# EAGLE design booster001 (EAGLE 4.16)
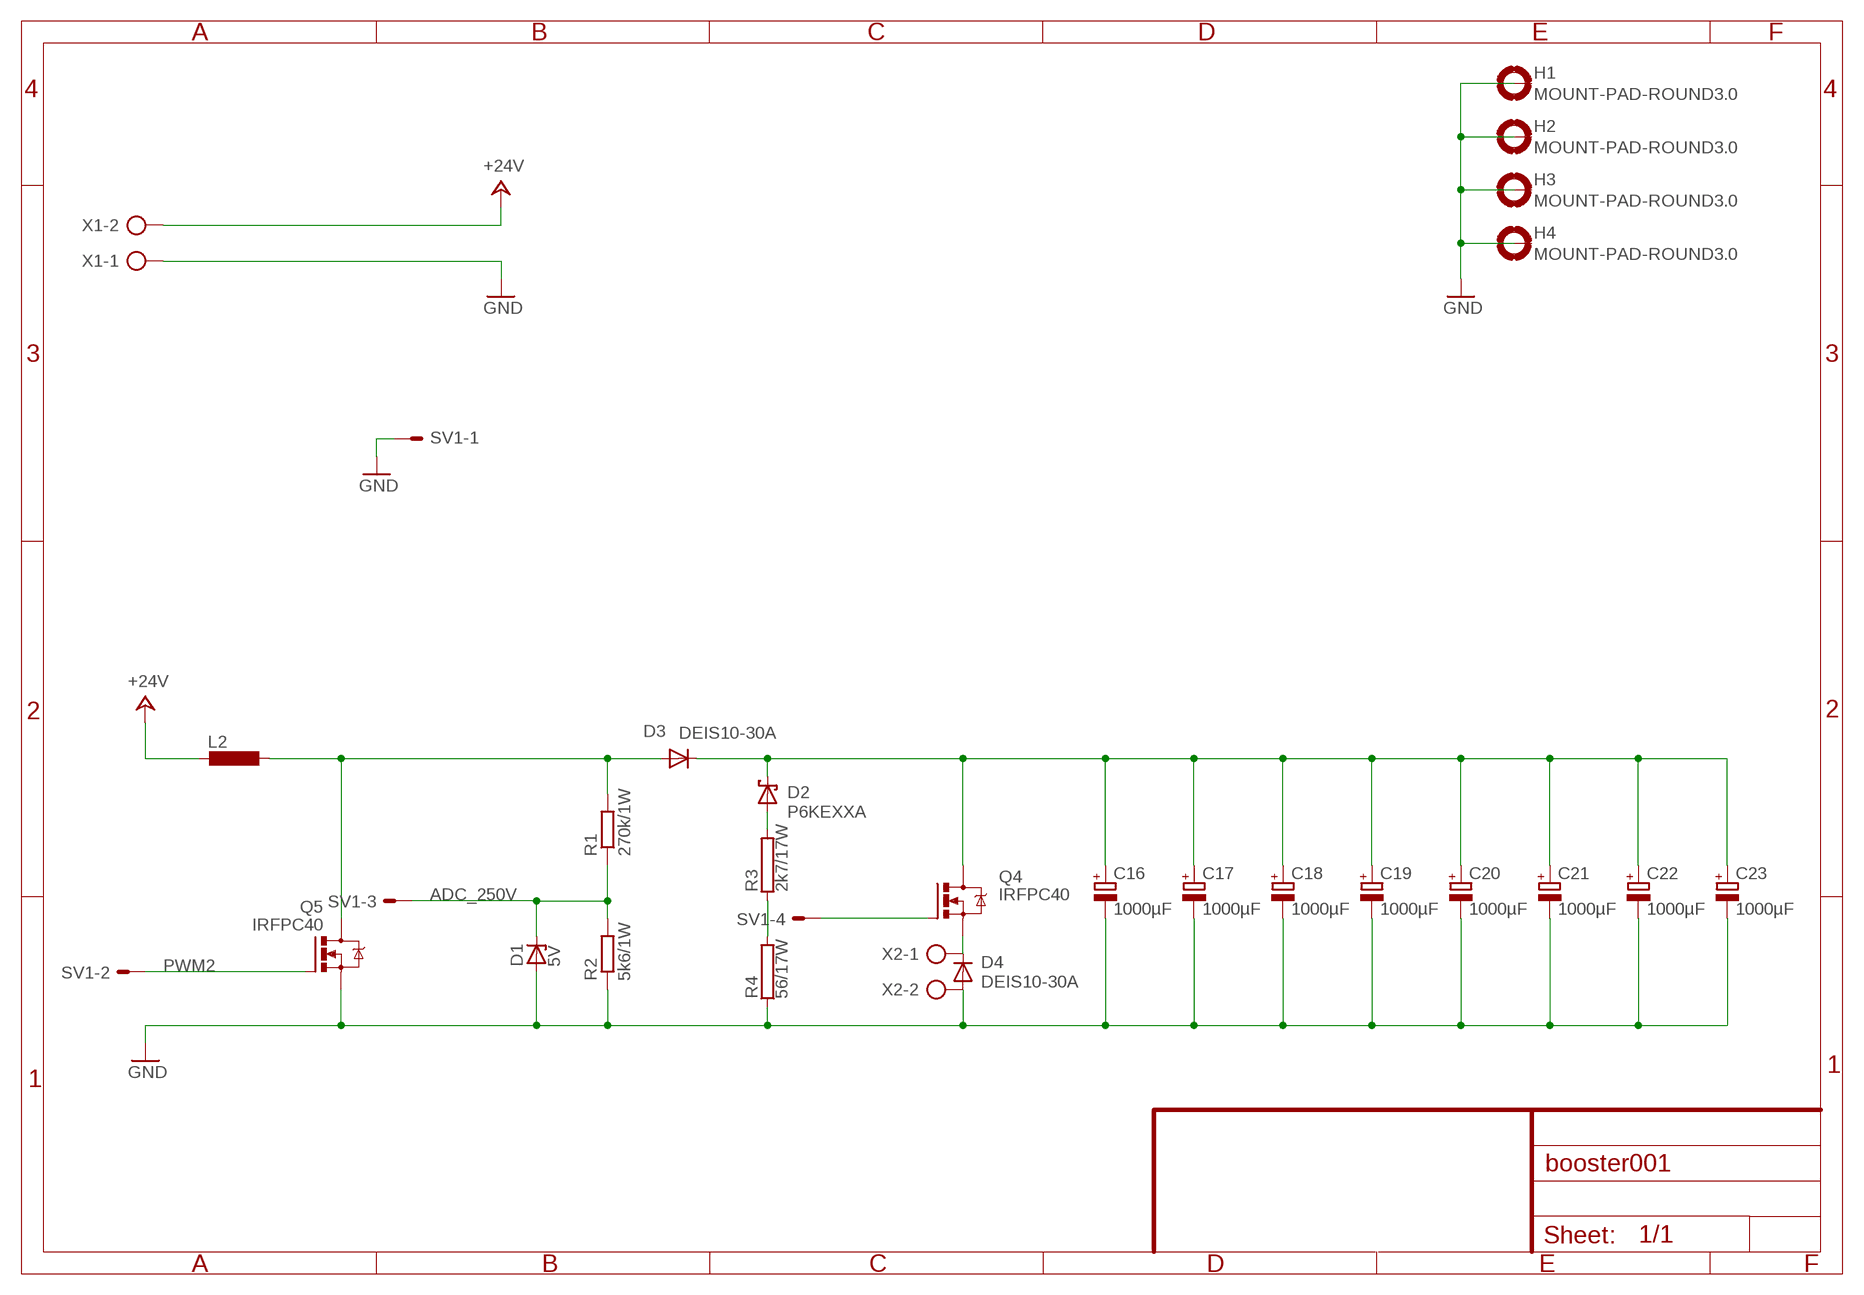
[diagram p0: schematic, sheet 1]

## Parts
C16  1000µF  CPOL-EUE10-35  [EB35D]
C17  1000µF  CPOL-EUE10-35  [EB35D]
C18  1000µF  CPOL-EUE10-35  [EB35D]
C19  1000µF  CPOL-EUE10-35  [EB35D]
C20  1000µF  CPOL-EUE10-35  [EB35D]
C21  1000µF  CPOL-EUE10-35  [EB35D]
C22  1000µF  CPOL-EUE10-35  [EB35D]
C23  1000µF  CPOL-EUE10-35  [EB35D]
D1  5V  ZENER-DIODESOT23  [SOT23]
D2  P6KEXXA  [C1702-15]
D3  DEIS10-30A  [TO247AD]
D4  DEIS10-30A  [TO247AD]
H1  MOUNT-PAD-ROUND3.0  [3,0-PAD]
H2  MOUNT-PAD-ROUND3.0  [3,0-PAD]
H3  MOUNT-PAD-ROUND3.0  [3,0-PAD]
H4  MOUNT-PAD-ROUND3.0  [3,0-PAD]
L2  L-EUTJ6-U1  [TJ6-U1]
Q4  IRFPC40  [TO247BV]
Q5  IRFPC40  [TO247BV]
R1  270k/1W  R-EU_0207/10  [0207/10]
R2  5k6/1W  R-EU_0207/10  [0207/10]
R3  2k7/17W  RKH218-8  [KH218-8]
R4  56/17W  RKH218-8  [KH218-8]
SV1  ML6LE  [ML6L]
X1  AK500/2-H  [AK500/2-H]
X2  AK500/2-H  [AK500/2-H]

## Nets
+24V [Power]: L2.2 X1.2
ADC_250V: D1.3(C) R1.1 R2.2 SV1.3
GND [Power]: C16.- C17.- C18.- C19.- C20.- C21.- C22.- C23.- D1.1(A) D4.A H1.B3,0(MOUNT) H2.B3,0(MOUNT) H3.B3,0(MOUNT) H4.B3,0(MOUNT) Q5.S R2.1 R4.1 SV1.1 X1.1 X2.2
N$1 [High Power]: D4.K(C) Q4.S X2.1
N$2: Q4.G SV1.4
N$3: R3.1 R4.2
N$4: D2.A R3.2
N$23 [High Power]: C16.+ C17.+ C18.+ C19.+ C20.+ C21.+ C22.+ C23.+ D2.C D3.K(C) Q4.D
N$32 [Power]: D3.A L2.1 Q5.D R1.2
PWM2: Q5.G SV1.2
Unconnected: SV1.5 SV1.6

## Library data of the parts
C16-C23 = rcl:CPOL-EU: POLARIZED CAPACITOR, European symbol
D1 = diode:ZENER-DIODE: Z-Diode
D2 = diode:P6KEXXA: DIODE transient-voltage suppressor
D3 D4 = carpenoctem:DEIS10-30A
H1-H4 = holes:MOUNT-PAD-ROUND: MOUNTING PAD, round
L2 = rcl:L-EU: INDUCTOR, European symbol
Q4 Q5 = transistor-power:IRFPC40: N-CHANNEL MOS FET
R1 R2 = rcl:R-EU_: RESISTOR, European symbol
R3 R4 = resistor-power:R: Power Resitor
SV1 = con-harting-ml:ML6?E: HARTING
X1 X2 = con-ptr500:AK500/2-H: CONNECTOR Aug. 2004 / PTR Meßtechnik: Die Bezeichnung der Serie AK505 wurde geändert. Es handelt sich hierbei um AK500 in horizontaler Ausführung.

## Net classes
1 Power: width 0.406 mm
2 High Power: width 2 mm

## Board
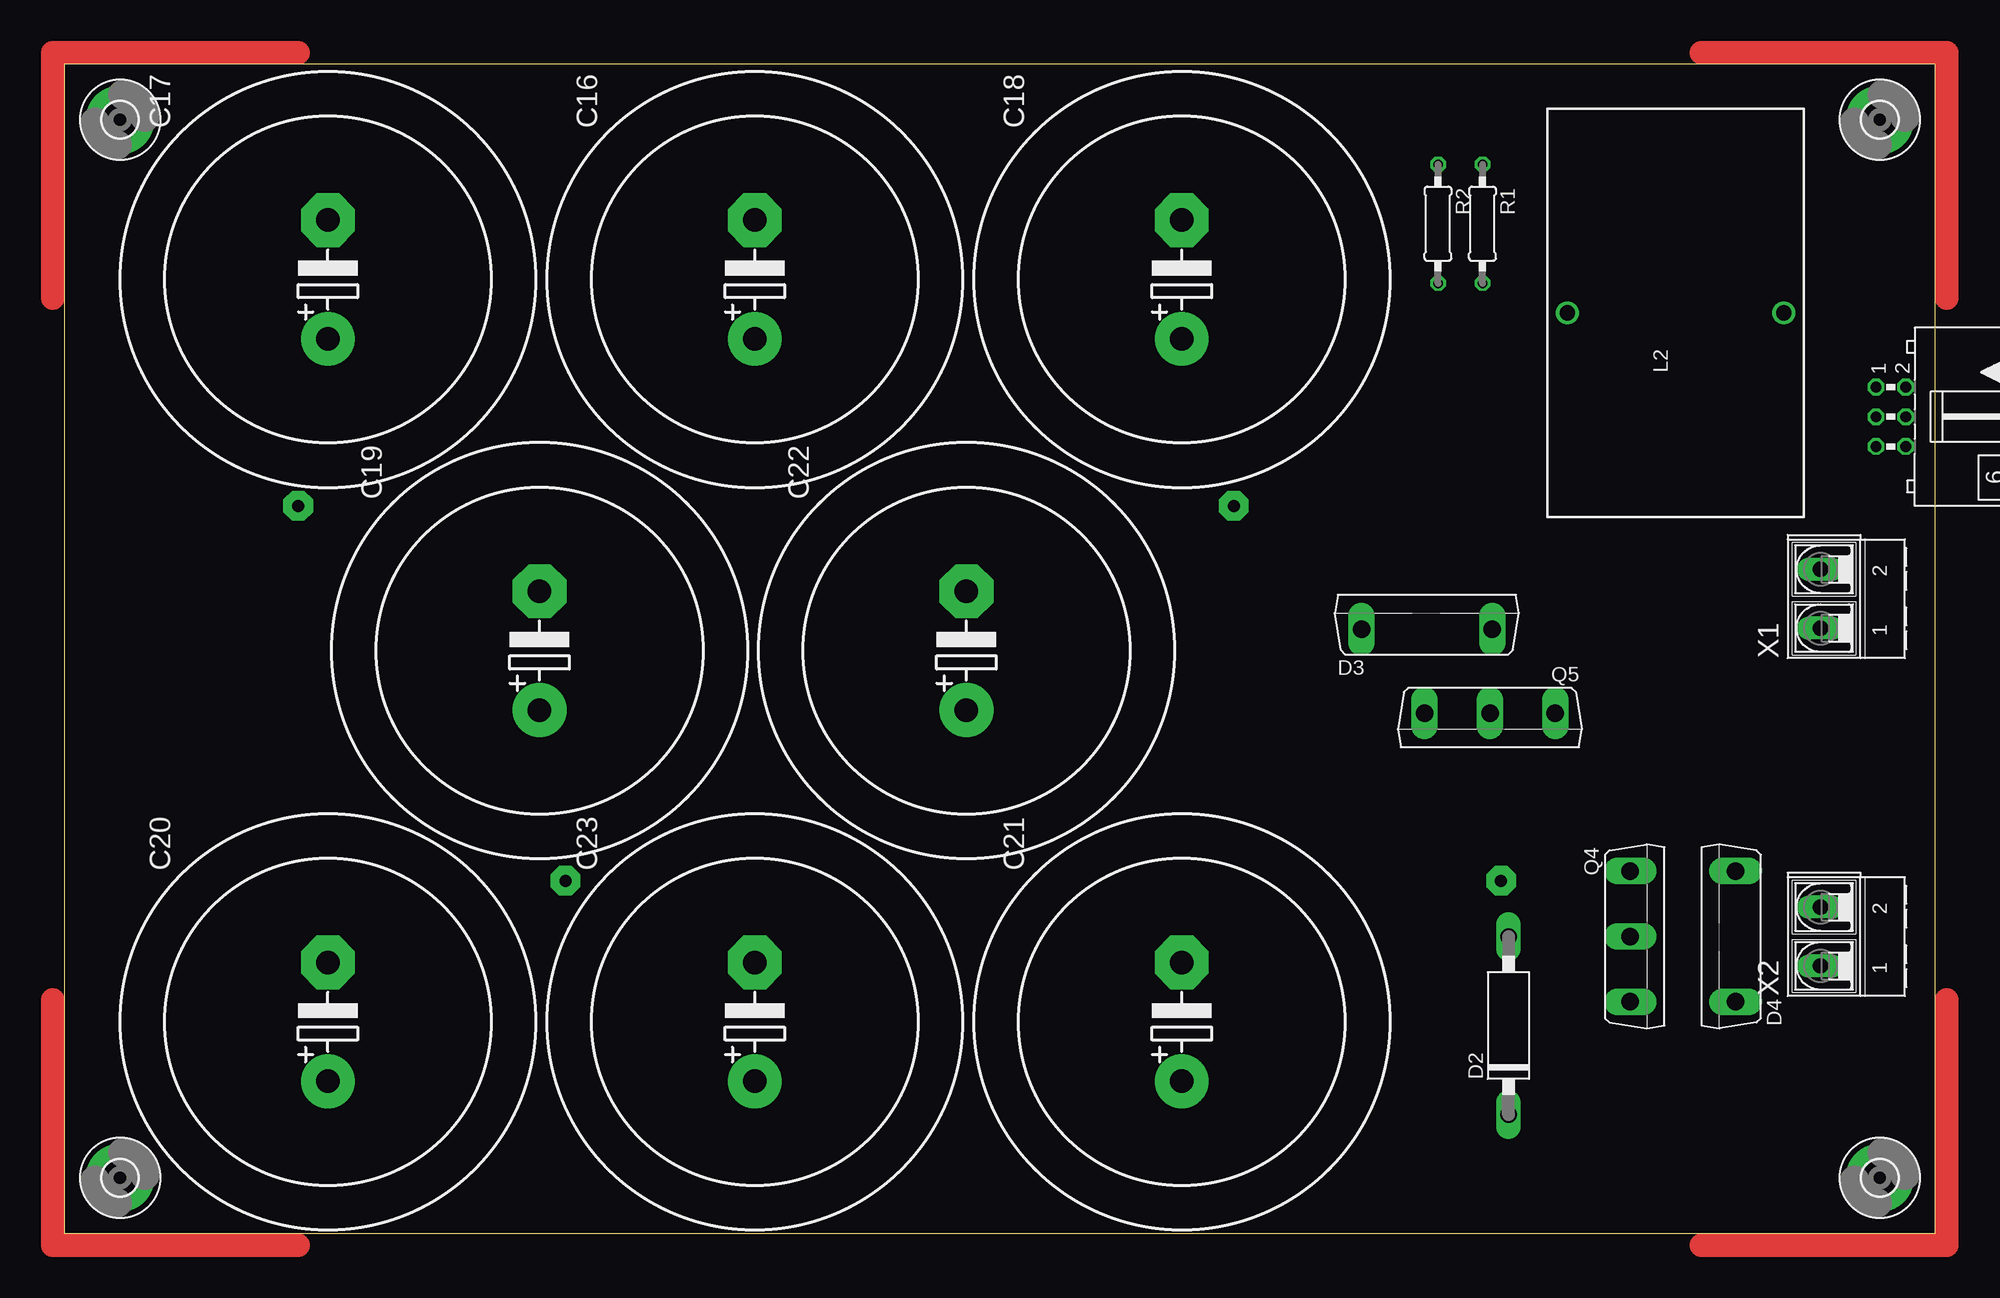
[diagram p1: board, top side]
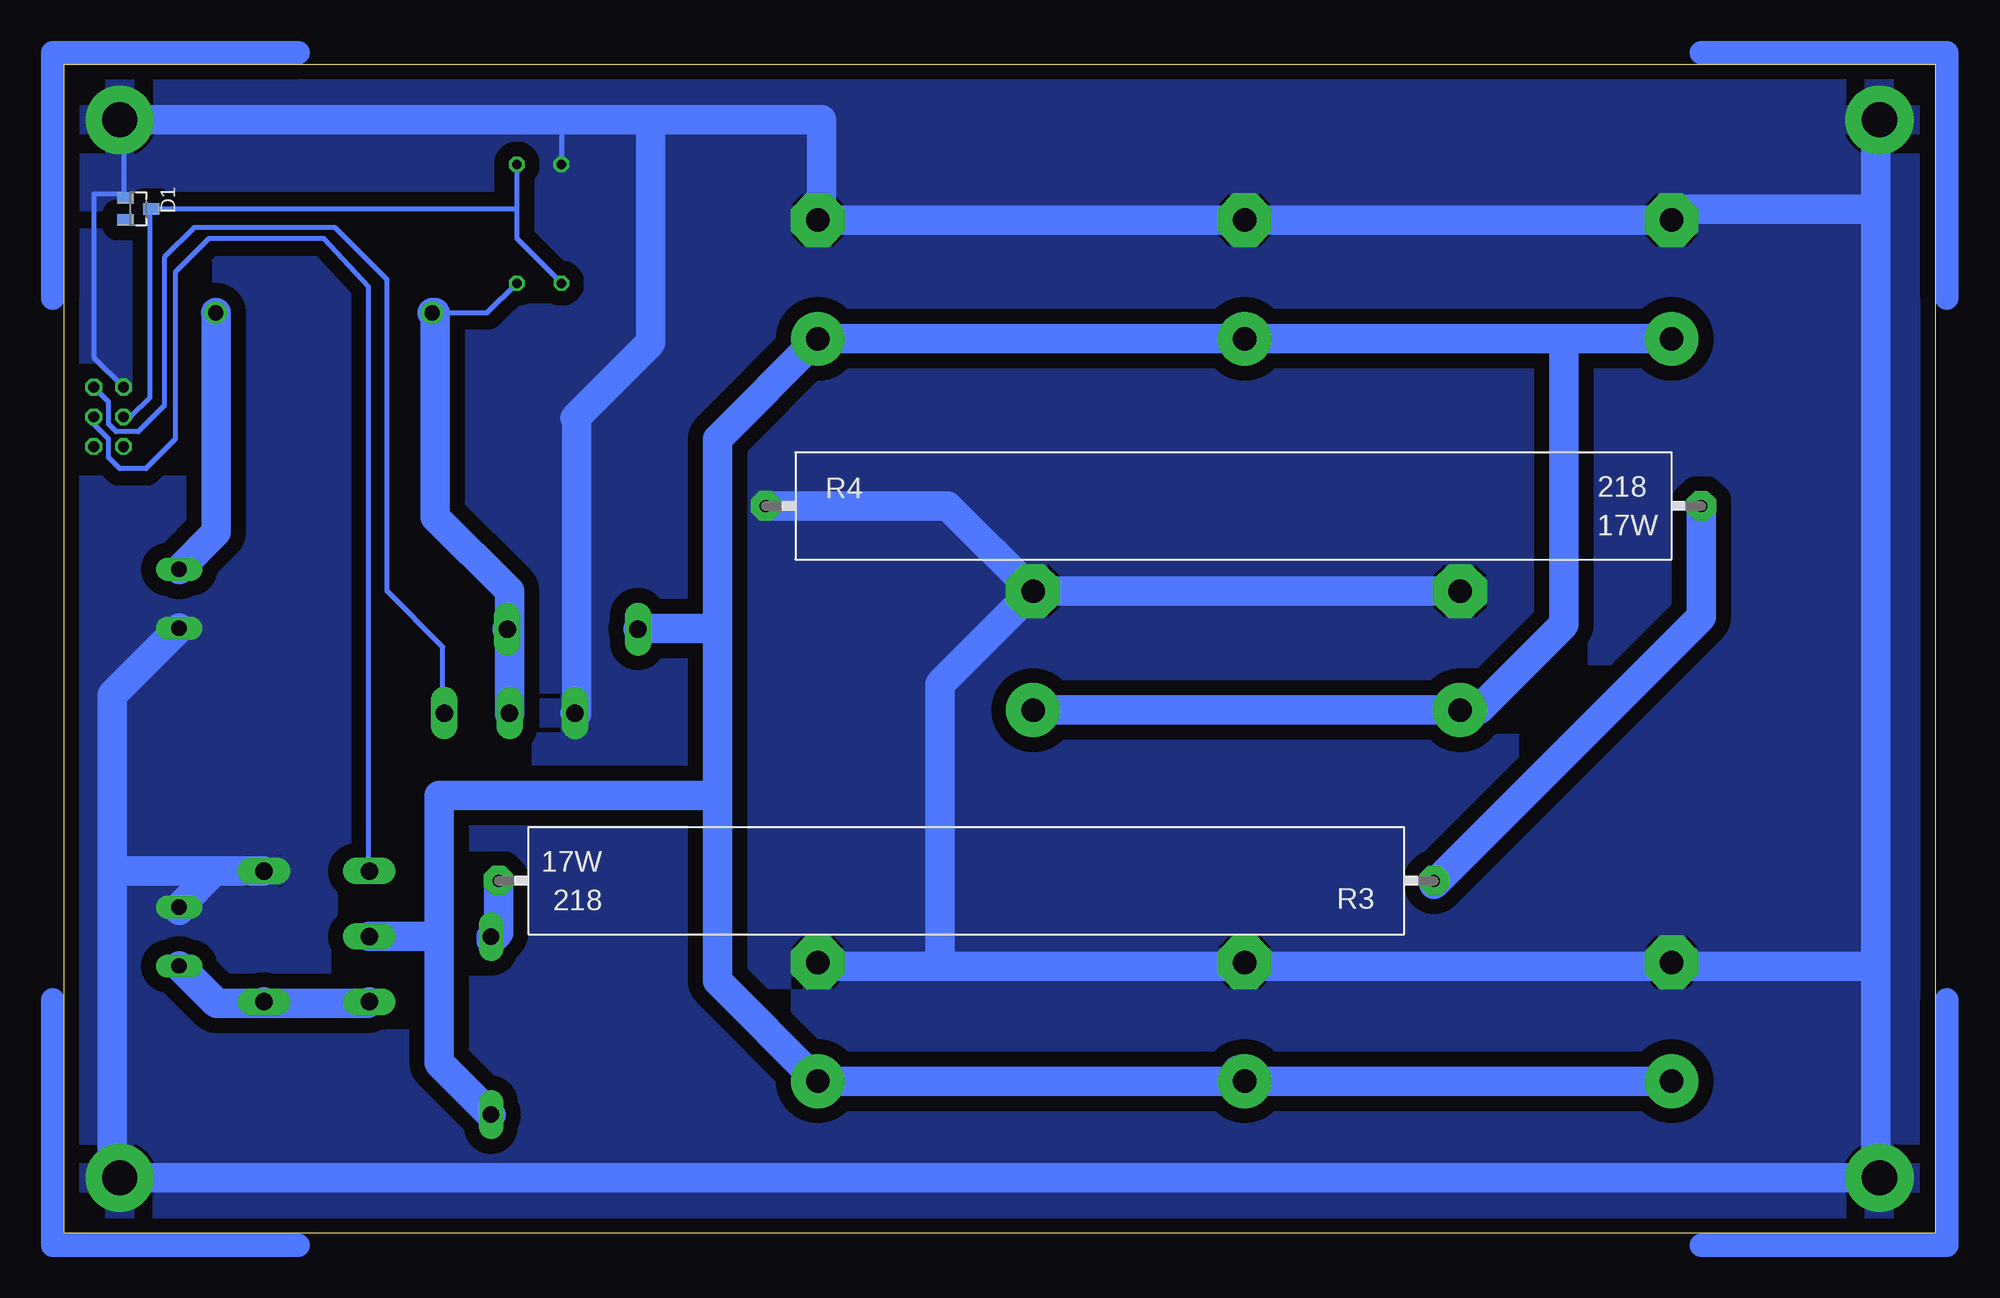
[diagram p2: board, bottom side, seen from below]

Size 160 x 100 mm. Coordinates in mm from the lower left corner, seen from the top.
Outline: 0,0 160,0 160,100 0,100 0,0
Copper layers (1*16): Top 0.035mm / dielectric 1.5mm / Bottom 0.035mm
Design rules "olimex_10mils": minimum track width 10mil, minimum drill 24mil, track to track 10mil, track to pad 10mil, pad to pad 10mil, via to via 10mil, smd to smd 10mil, copper to edge 40mil, drill to drill 10mil, minimum pad ring 10mil, minimum via ring 8mil, stop-mask expansion 0mil, vias tented up to drill 0mil, thermal gap 10mil

### Footprints (pad centres in the part's own frame; a part is rotated, then mirrored left to right if it is on the bottom)
EB35D = drill 2.007 pad 4.597 round: + -5.08,0 | drill 2.007 pad 4.597 octagon: - 5.08,0
SOT23 = smd 1 x 1.4: 1 -0.95,-1.1; 2 0.95,-1.1; 3 0,1.1
C1702-15 = drill 1.397 long: A 7.62,0; C -7.62,0
TO247AD = drill 1.499 long: A 5.588,-0.381; K -5.588,-0.381
3,0-PAD = drill 3 pad 5.842 round: B3,0 0,0
TJ6-U1 = drill 1.3 round: 1 -9.25,0; 2 9.25,0
TO247BV = drill 1.499 long: D 0,-2.921; G -5.588,-2.921; S 5.588,-2.921
0207/10 = drill 0.813 octagon: 1 -5.08,0; 2 5.08,0
KH218-8 = drill 1.016 pad 2.54 octagon: 1 -40.005,0; 2 40.005,0
ML6L = drill 0.914 octagon: 1 -2.54,-1.27; 2 -2.54,1.27; 3 0,-1.27; 4 0,1.27; 5 2.54,-1.27; 6 2.54,1.27
AK500/2-H = drill 1.321 long: 1 -2.515,0; 2 2.515,0

### Placement (x,y rotation side)
C16  59.05,81.6 90 top
C17  22.54,81.6 90 top
C18  95.57,81.6 90 top
C19  40.64,49.85 90 top
C20  22.54,18.1 90 top
C21  95.57,18.1 90 top
C22  77.15,49.85 90 top
C23  59.05,18.1 90 top
D1  153.67,87.63 270 bottom
D2  123.51,17.78 90 top
D3  116.52,52.07 0 top
D4  142.56,25.4 90 top
H1  4.76,4.76 0 top
H2  4.76,95.25 0 top
H3  155.26,95.25 0 top
H4  155.26,4.76 0 top
L2  137.79,78.74 0 top
Q4  136.84,25.4 270 top
Q5  121.92,41.59 180 top
R1  121.28,86.36 270 top
R2  117.47,86.36 270 top
R3  82.87,30.16 180 bottom
R4  60.01,62.23 0 bottom
SV1  156.21,69.85 270 top
X1  150.18,54.29 90 top
X2  150.18,25.4 90 top

### Tracks (layer width: path | path; a pad name or v marks a point on that pad's centre or on a via)
+24V
  Bottom 2.54: L2.2 147,78.74 147,59.98 X1.2
ADC_250V
  Bottom 0.406: D1.3 152.4,87.63 152.72,87.31 152.72,71.44 154.31,69.85 SV1.3 | D1.3 152.4,87.46 | D1.3 152.72,87.63 | R2.2 121.28,85.09 121.28,87.63 | 121.28,87.63 R1.1 | 121.28,87.63 D1.3
GND
  Bottom 0.406: 154.94,95.25 154.94,88.9 | SV1.1 157.48,74.93 157.48,88.9 154.94,88.9 | 154.94,88.9 154.94,88.75 D1.1 | 117.47,95.25 R2.1
  Bottom 2.54: 147.13,30.99 D4.A | 147.13,30.99 150.18,27.94 X2.2 150.18,27.62 | C18.- C16.- 22.23,86.68 | C18.- 95.89,86.68 95.89,86.36 | 22.23,86.68 C17.- | 22.23,86.68 22.23,87 21.59,87.63 5.08,87.63 | C22.- C19.- | 22.86,22.86 C20.- | 22.86,22.86 59.69,22.86 | C21.- 95.25,22.86 85.09,22.86 | 59.69,22.86 85.09,22.86 | C22.- 85.09,46.99 85.09,22.86 | H2.B3,0 5.08,95.25 5.08,87.63 | H1.B3,0 5.08,5.08 5.08,22.86 | 5.08,22.86 5.08,87.63 | 5.08,22.86 22.86,22.86 | 95.25,86.68 95.25,86.36 | C18.- 95.25,86.68 | 109.86,95.25 95.25,95.25 95.25,86.68 | 109.86,95.25 117.47,95.25 154.94,95.25 H3.B3,0 | H1.B3,0 5.08,4.45 | 155.89,30.8 155.89,5.4 H4.B3,0 | H4.B3,0 154.94,4.45 | 147.13,30.99 155.7,30.99 155.89,30.8 | 109.86,95.25 109.86,76.2 116.33,69.72 116.2,69.6 116.2,44.45 116.27,44.45 Q5.S | C22.- 76.83,54.61 | R4.1 84.45,62.23 C22.- | 59.69,22.86 59.69,22.54 C23.- | H1.B3,0 4.45,4.76 | H1.B3,0 H4.B3,0 | X1.1 155.89,46.06 155.89,30.8
  pour Bottom (isolate 1.27): 0,100.33 160.02,100.33 160.02,0 0,0
N$1
  Bottom 2.54: X2.1 146.98,19.68 143.19,19.68 | 143.19,19.68 142.88,19.68 142.88,19.75 D4.K 143.06,19.68 143.19,19.68 | Q4.S 134.05,19.68 143.19,19.68
N$2
  Bottom 0.406: SV1.4 157.48,69.22 156.21,67.94 156.21,66.36 155.26,65.41 153.03,65.41 150.5,67.94 150.5,82.23 147.64,85.09 137.79,85.09 133.99,80.96 133.99,31.05 Q4.G
N$3
  Bottom 2.54: R3.1 42.86,29.84 20,52.7 R4.2
N$4
  Bottom 2.54: D2.A 123.51,25.08 122.87,25.72 R3.2
N$23
  Bottom 2.54: 31.75,76.52 C17.+ | C16.+ 31.75,76.52 | C16.+ 59.69,76.52 | 59.69,76.52 59.69,76.83 | 59.69,76.52 59.69,76.2 | C18.+ C16.+ | C16.+ 59.05,76.83 | 31.75,76.52 31.75,52.07 39.05,44.77 C19.+ 40.64,44.45 40.96,44.77 C22.+ | C20.+ 58.42,13.02 | 58.42,13.02 58.74,13.02 | 58.74,13.02 59.69,13.97 59.69,12.7 | 58.42,13.02 58.42,12.7 58.74,13.02 | C18.+ 104.14,67.94 104.14,66.04 | 104.14,37.47 104.14,21.59 C21.+ C23.+ 58.74,13.02 | 104.14,37.47 104.14,51.75 | 104.14,51.75 104.14,61.91 104.14,66.04 | C18.+ 95.89,76.2 | 104.14,66.04 104.14,66.17 | 127.95,25.4 Q4.D | 127.95,25.4 127.95,37.47 104.14,37.47 | D2.C 127.95,14.61 127.95,25.4 | D3.K 110.87,51.75 104.14,51.75
N$32
  Bottom 0.406: R1.2 123.83,78.74 128.27,78.74
  Bottom 2.54: 128.27,78.42 128.27,77.34 | 128.27,78.42 128.27,78.74 L2.1 128.54,78.7 128.27,78.42 | 128.27,78.42 128.27,61.28 121.92,54.93 121.92,51.75 | 121.92,44.45 Q5.D 121.92,51.75 | 121.92,51.75 122.05,51.75 D3.A
PWM2
  Bottom 0.406: SV1.2 156.21,71.12 156.21,69.22 155.57,68.58 153.67,68.58 151.45,70.8 151.45,83.5 148.91,86.04 136.84,86.04 132.4,81.6 132.4,54.93 127.64,50.16 127.64,44.45 127.57,44.45 Q5.G
S$1
  Top 2: 20,-1 -1,-1 -1,20
S$2
  Top 2: 140,-1 161,-1 161,20
S$3
  Top 2: 20,101 -1,101 -1,80
S$4
  Top 2: 161,80 161,101 140,101
S$5
  Bottom 2: 20,-1 -1,-1 -1,20
S$6
  Bottom 2: 140,-1 161,-1 161,20
S$7
  Bottom 2: 20,101 -1,101 -1,80
S$8
  Bottom 2: 161,80 161,101 140,101